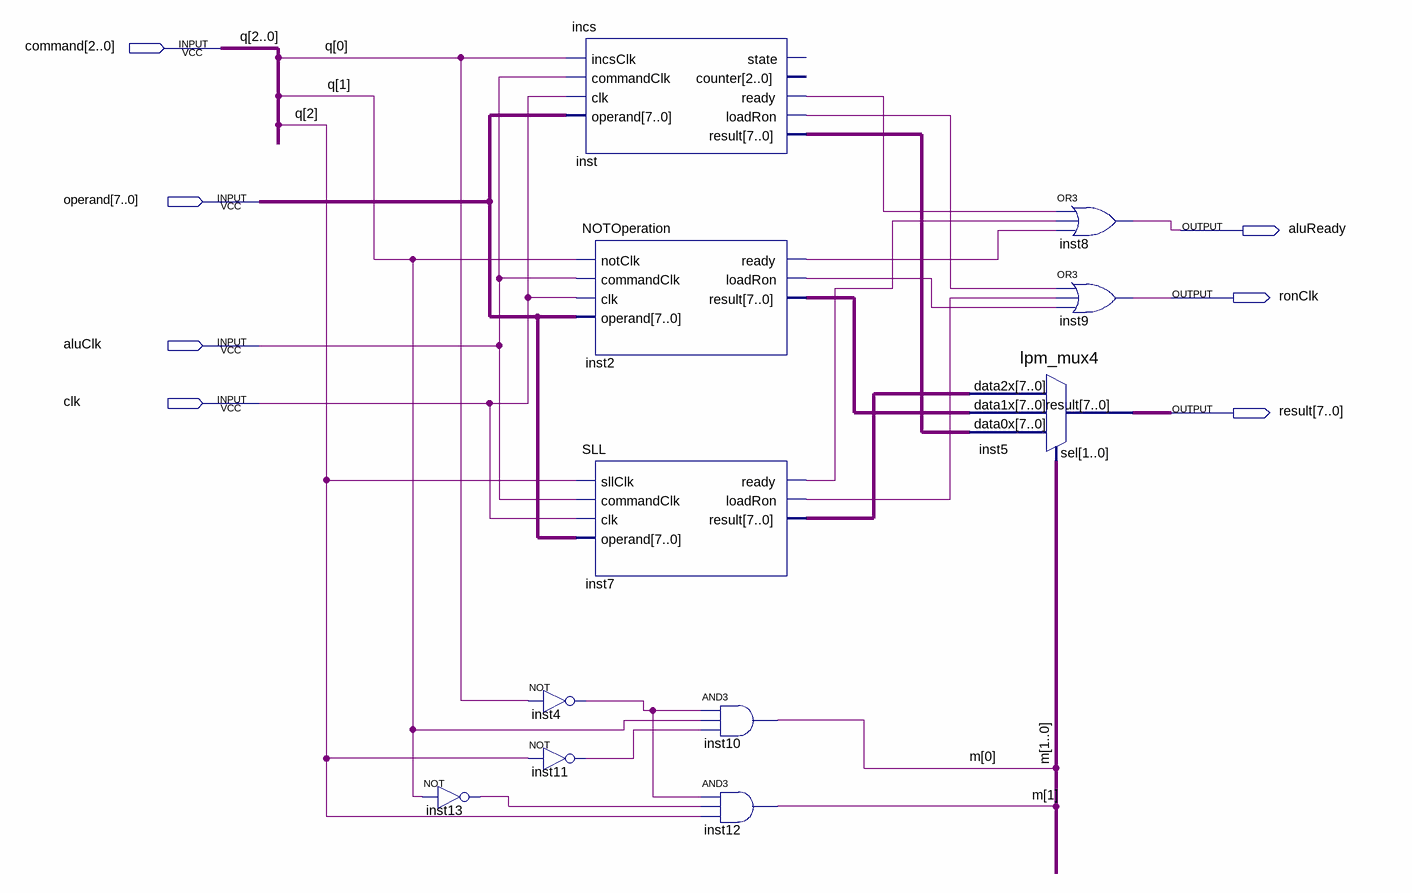
[diagram p0: schematic sheet]
// Quartus schematic ALU.bdf as structural Verilog: 11 symbols, 7 pins
module ALU (
  input  [2:0] command,
  input  [7:0] operand,
  input  aluClk,
  input  clk,
  output aluReady,
  output ronClk,
  output [7:0] result
);

  wire inst2_loadron, inst2_ready, inst4_out, inst7_loadron, inst7_ready, inst11_out, inst13_out,
       inst_loadron, inst_ready;
  wire [1:0] m;
  wire [7:0] inst2_result, inst7_result, inst_result;

  not inst13 (inst13_out, command[1]);
  incs inst (
    .incsClk(command[0]), .commandClk(aluClk), .clk(clk), .operand(operand), .ready(inst_ready),
    .loadRon(inst_loadron), .result(inst_result));  // open: state, counter
  NOTOperation inst2 (
    .notClk(command[1]), .commandClk(aluClk), .clk(clk), .operand(operand), .ready(inst2_ready),
    .loadRon(inst2_loadron), .result(inst2_result));
  SLL inst7 (
    .sllClk(command[2]), .commandClk(aluClk), .clk(clk), .operand(operand), .ready(inst7_ready),
    .loadRon(inst7_loadron), .result(inst7_result));
  not inst4 (inst4_out, command[0]);
  not inst11 (inst11_out, command[2]);
  and inst10 (m[0], inst4_out, command[1], inst11_out);
  and inst12 (m[1], inst4_out, inst13_out, command[2]);
  lpm_mux4 inst5 (.data2x(inst7_result), .data1x(inst2_result), .data0x(inst_result), .sel(m), .result(result));
  or inst8 (aluReady, inst_ready, inst7_ready, inst2_ready);
  or inst9 (ronClk, inst_loadron, inst7_loadron, inst2_loadron);

  // Other names for the same wires on the sheet: q[2:0] = command
endmodule
